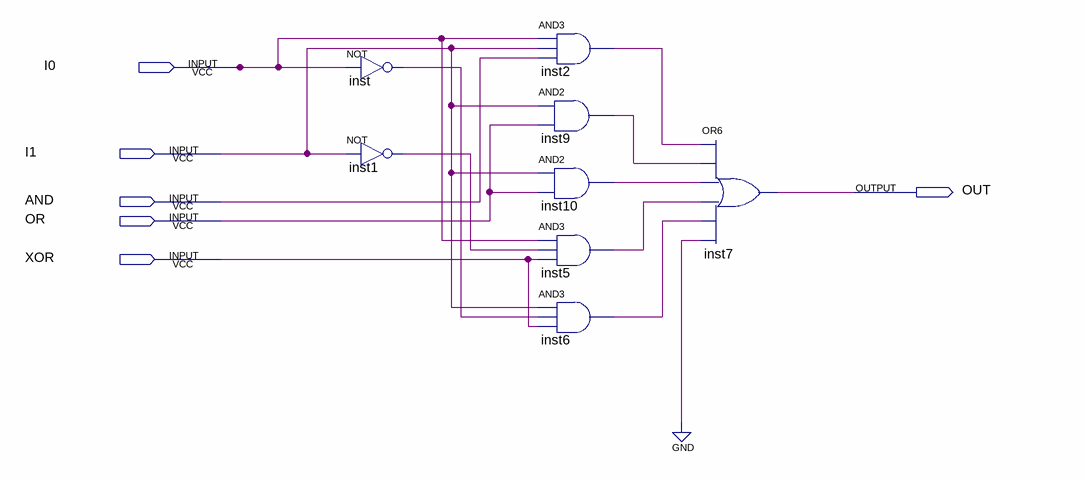
[diagram p0: schematic sheet]
// Quartus schematic Block1.bdf as structural Verilog: 8 symbols, 6 pins
module Block1 (
  input  I0,
  input  I1,
  input  AND,
  input  OR,
  input  XOR,
  output OUT
);

  wire inst1_out, inst2_out, inst5_out, inst6_out, inst9_out, inst10_out, inst_out;

  not inst (inst_out, I0);
  not inst1 (inst1_out, I1);
  and inst2 (inst2_out, I0, I1, AND);
  and inst9 (inst9_out, I1, OR);
  and inst10 (inst10_out, I1, OR);
  and inst5 (inst5_out, I0, inst1_out, XOR);
  and inst6 (inst6_out, I1, inst_out, XOR);
  or inst7 (OUT, inst2_out, inst9_out, inst10_out, inst5_out, inst6_out, 1'b0);
endmodule
